# EAGLE design Display (EAGLE 9.6.2)
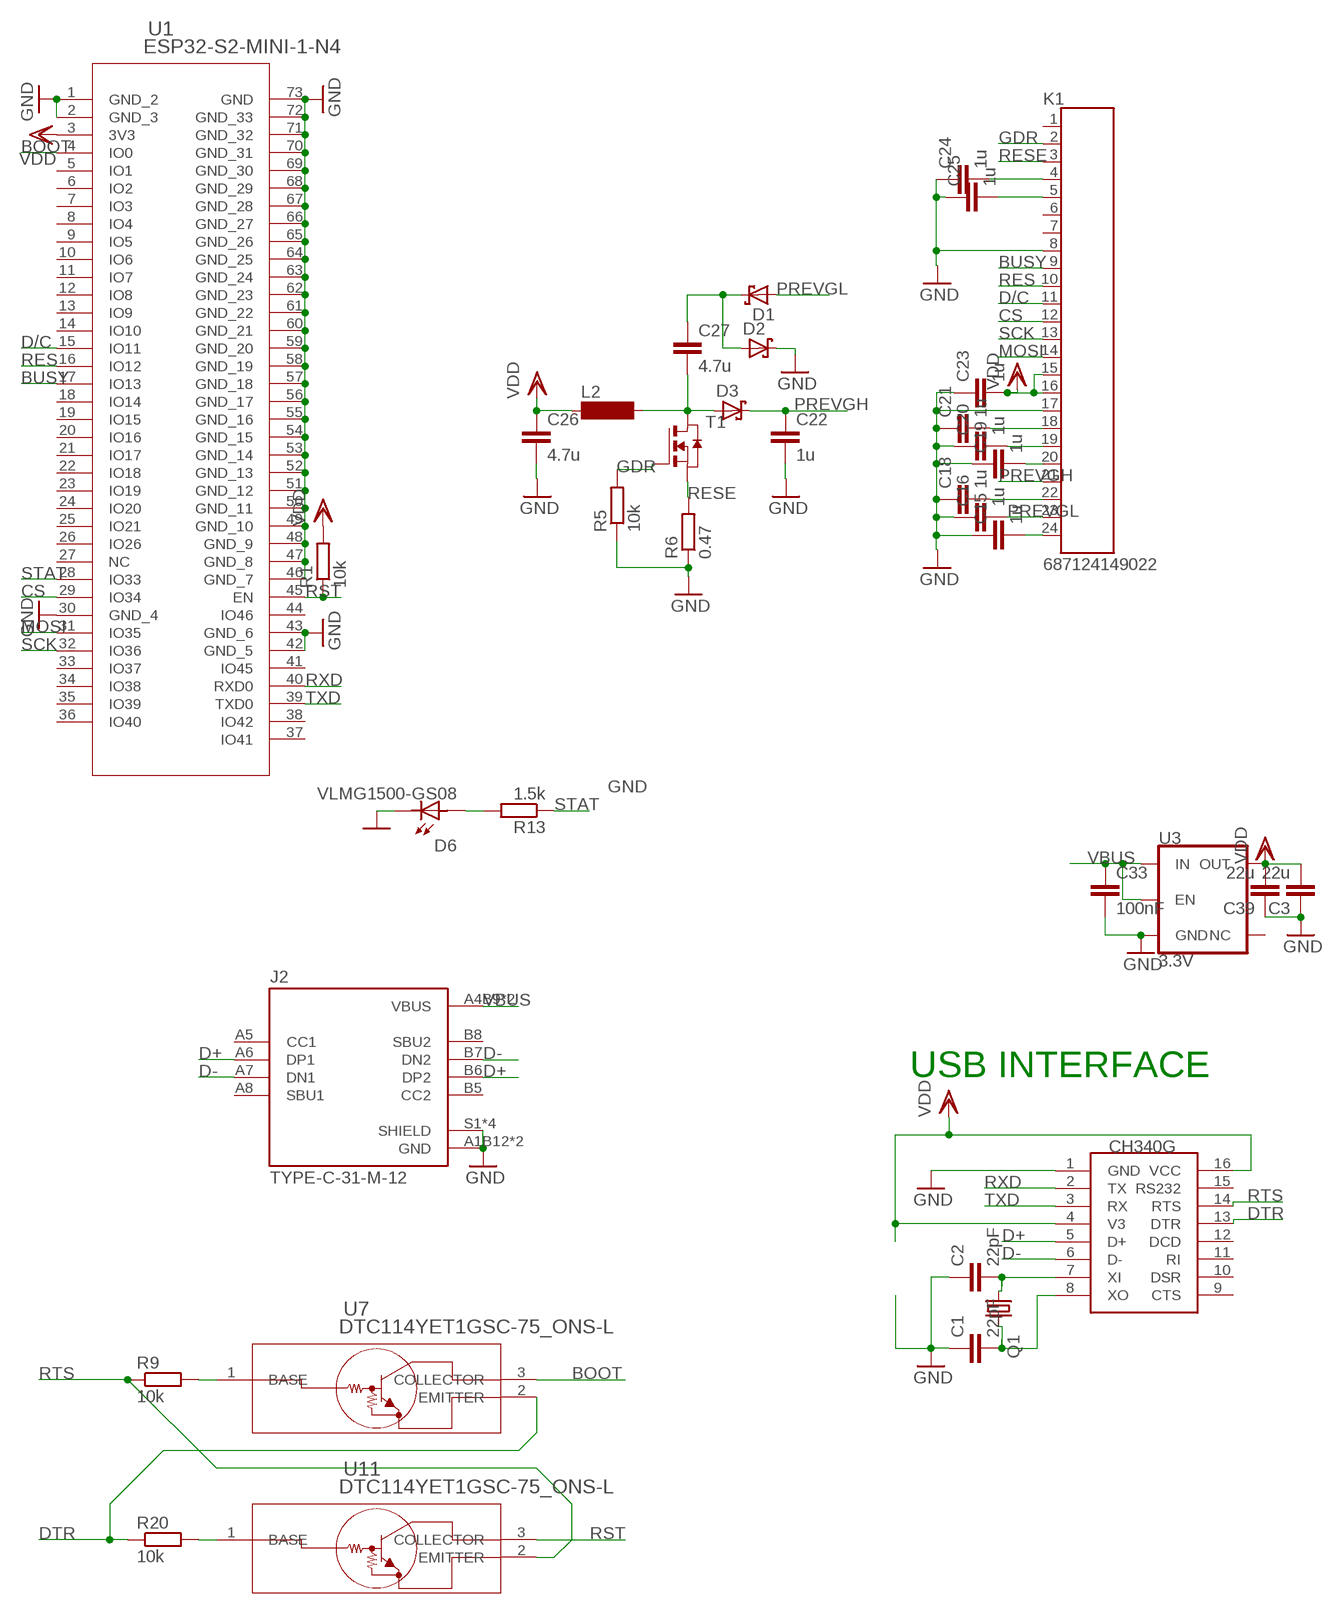
[diagram p0: schematic, sheet 1]

## Parts
C1  22pF  CC0402  [C0402]
C2  22pF  CC0402  [C0402]
C3  22u  CC0603R  [C0603R]
C15  1u  CC0402  [C0402]
C16  1u  CC0402  [C0402]
C18  1u  CC0402  [C0402]
C19  1u  CC0402  [C0402]
C20  1u  CC0402  [C0402]
C21  1u  CC0402  [C0402]
C22  1u  CC0402  [C0402]
C23  1u  CC0402  [C0402]
C24  1u  CC0402  [C0402]
C25  1u  CC0402  [C0402]
C26  4.7u  CC0402  [C0402]
C27  4.7u  CC0402  [C0402]
C33  100nF  CC0402  [C0402]
C39  22u  CC0603R  [C0603R]
D1  1PS79SB30,115  [SOD523]
D2  1PS79SB30,115  [SOD523]
D3  1PS79SB30,115  [SOD523]
D6  VLMG1500-GS08  [LEDC1005X35N]
J2  TYPE-C-31-M-12  [HRO_TYPE-C-31-M-12]
K1  687124149022  [687124149022]
L2  SM-NE29  [SM-NE29]
Q1  KX-7  [3.2X2.5_KX-7]
R1  10k  RR0402  [R0402]
R5  10k  RR0402  [R0402]
R6  0.47  RR0402  [R0402]
R9  10k  RR0402  [R0402]
R13  1.5k  RR0402  [R0402]
R20  10k  RR0402  [R0402]
T1  NMOSSOT23  [SOT-23]
U1  ESP32-S2-MINI-1-N4  [ESP32-S2-MINI-1-N4_EXP]
U3  3.3V  V_REG_AP2112K-3.3V  [SOT23-5]
U5  H  CH340G  [SOIC16]
U7  DTC114YET1GSC-75_ONS-L  [SC-75_ONS-L]
U11  DTC114YET1GSC-75_ONS-L  [SC-75_ONS-L]

## Nets
BOOT: U1.4(IO0) U7.3(COLLECTOR)
BUSY: K1.9 U1.17(IO13)
CS: K1.12 U1.29(IO34)
D+: J2.A6(DP1) J2.B6(DP2) U5.5(D+)
D-: J2.A7(DN1) J2.B7(DN2) U5.6(D-)
D/C: K1.11 U1.15(IO11)
DTR: R20.1 U5.13(DTR) U7.2(EMITTER)
GDR: K1.2 R5.2 T1.3(G)
GND: C1.1 C2.1 C3.1 C15.1 C16.1 C18.1 C19.1 C20.1 C21.1 C22.2 C23.1 C24.1 C25.1 C26.2 C33.2 C39.1 D2.1(K) D6.2 J2.A1B12(GND) J2.B1A12(GND) J2.S1(SHIELD) J2.S2(SHIELD) J2.S3(SHIELD) J2.S4(SHIELD) K1.8 K1.17 R5.1 R6.1 U1.1(GND_2) U1.2(GND_3) U1.30(GND_4) U1.42(GND_5) U1.43(GND_6) U1.46(GND_7) U1.47(GND_8) U1.48(GND_9) U1.49(GND_10) U1.50(GND_11) U1.51(GND_12) U1.52(GND_13) U1.53(GND_14) U1.54(GND_15) U1.55(GND_16) U1.56(GND_17) U1.57(GND_18) U1.58(GND_19) U1.59(GND_20) U1.60(GND_21) U1.61(GND_22) U1.62(GND_23) U1.63(GND_24) U1.64(GND_25) U1.65(GND_26) U1.66(GND_27) U1.67(GND_28) U1.68(GND_29) U1.69(GND_30) U1.70(GND_31) U1.71(GND_32) U1.72(GND_33) U1.73(GND) U3.2(GND) U5.1(GND)
MOSI: K1.14 U1.31(IO35)
N$5: C1.2 Q1.3 U5.8(XO)
N$7: C27.2 D3.2(A) L2.2 T1.1(D)
N$8: C21.2 K1.18
N$9: C2.2 Q1.1 U5.7(XI)
N$12: C18.2 K1.22
N$13: C20.2 K1.19
N$14: C19.2 K1.20
N$16: C15.2 K1.24
N$19: C24.2 K1.4
N$20: C25.2 K1.5
N$22: C27.1 D1.1(K) D2.2(A)
N$27: D6.1 R13.2
N$29: R20.2 U11.1(BASE)
N$30: R9.2 U7.1(BASE)
PREVGH: C22.1 D3.1(K) K1.21
PREVGL: C16.2 D1.2(A) K1.23
RES: K1.10 U1.16(IO12)
RESE: K1.3 R6.2 T1.2(S)
RST: R1.1 U1.45(EN) U11.3(COLLECTOR)
RTS: R9.1 U5.14(RTS) U11.2(EMITTER)
RXD: U1.40(RXD0) U5.2(TX)
SCK: K1.13 U1.32(IO36)
STAT: R13.1 U1.28(IO33)
TXD: U1.39(TXD0) U5.3(RX)
VBUS: C33.1 J2.A4B9(VBUS) J2.B4A9(VBUS) U3.1(IN) U3.3(EN)
VDD: C3.2 C23.2 C26.1 C39.2 K1.15 K1.16 L2.1 R1.2 U1.3(3V3) U3.5(OUT) U5.4(V3) U5.16(VCC)
Unconnected: J2.A5(CC1) J2.A8(SBU1) J2.B5(CC2) J2.B8(SBU2) K1.1 K1.6 K1.7 U1.5(IO1) U1.6(IO2) U1.7(IO3) U1.8(IO4) U1.9(IO5) U1.10(IO6) U1.11(IO7) U1.12(IO8) U1.13(IO9) U1.14(IO10) U1.18(IO14) U1.19(IO15) U1.20(IO16) U1.21(IO17) U1.22(IO18) U1.23(IO19) U1.24(IO20) U1.25(IO21) U1.26(IO26) U1.27(NC) U1.33(IO37) U1.34(IO38) U1.35(IO39) U1.36(IO40) U1.37(IO41) U1.38(IO42) U1.41(IO45) U1.44(IO46) U3.4(NC) U5.9(CTS) U5.10(DSR) U5.11(RI) U5.12(DCD) U5.15(RS232)

## Notes on the sheet
- USB INTERFACE

## Library data of the parts
C1 C2 C15 C16 C18-C27 C33 = eagle-ltspice:C: CAPACITOR, European symbol; SPICEMODEL: NONE; SPICEPREFIX: C
C3 C39 = eagle-ltspice:C: CAPACITOR, European symbol
D1-D3 = 1PS79SB30_115:1PS79SB30,115: 4 V, 30 mA low Cd Schottky barrier diode Planar low capacitance Schottky barrier diode encapsulated in a very small SMD plastic package. AAL Eindhoven MK; AVAILABILITY: Unavailable; DESCRIPTION: 1PS79SB30 Series 40 V 200 mA Surface Mount Schottky Barrier Diode - SOD-523; MF: Nexperia; MP: 1PS79SB30,115; PACKAGE: SOD-523 Nexperia; PRICE: None
D6 = VLMG1500-GS08:VLMG1500-GS08: 0402 GREEN 571nm 35MCD 65° Rectangle with Flat Top SMT LED; AVAILABILITY: Unavailable; DESCRIPTION: 0402 GREEN 571nm 35MCD 65° Rectangle with Flat Top SMT LED; MF: Vishay; MP: VLMG1500-GS08; PACKAGE: 0402 Vishay; PRICE: None
J2 = TYPE-C-31-M-12:TYPE-C-31-M-12: USB Connectors 24 Receptacle 1 8.94*7.3mm RoHS Check prices <https://pricing.snapeda.com/parts/TYPE-C-31-M-12/HRO%20Electronics%20Co.%2C%20Ltd./view-part?ref=eda>; AVAILABILITY: Not in stock; DESCRIPTION: USB Connectors 24 Receptacle 1 8.94*7.3mm RoHS; MF: HRO Electronics Co., Ltd.; MP: TYPE-C-31-M-12; PACKAGE: Package; PRICE: None
K1 = 687124149022:687124149022: WR-FPC 0.50mm SMT Horiz. Bot. Contact Hinge type WR-FPC 0.50mm 24 pins Hinge type SMT Horizontal Bottom Contact ;=>Code : Con_FPC_ZIF_0.50_6871xx149022_687124149022 <http://katalog.we-online.de/media/images/eican/Con_FPC_ZIF_0.50_687115149022_pf2.jpg> Details see: http://katalog.we-online.de/em/datasheet/6871xx149022.pdf Created 2014-10-08, Karrer Zheng 2014 (C) Wurth Elektronik; AVAILABILITY: Unavailable; DESCRIPTION: FFC / FPC Board Connector, WR-FPC Series, Surface Mount, Receptacle, 24, Bottom, 0.5 mm; MF: Wurth Electronics; MP: 687124149022; PACKAGE: None; PRICE: None
L2 = inductor-neosid:SM-NE29: INDUCTOR SMD chip inductor; OC_FARNELL: unknown; OC_NEWARK: unknown
Q1 = crystal-geyer_V1_0:KX: Quartz Crystals (MHz) SMD: KX - Serie Model Size l/w/h [mm] Frequency Range Frequency Stability Temp. Range [°C] Load Capacitance AECQ 200 availabel Datasheet KX-4 KX-5 KX-6 KX-7 KX-9A KX-9B KX-12A KX-12B KX-13 KX-20 KX-K KX-KS 1.6/1.2/0.3 2.0/1.6/0.45 2.5/2.0/0.55 3.2/2.5/0.8 5.0/3.2/1.0 5.0/3.2/1.1 6.0/3.5/1.1 6.0/3.5/1.0 7.0/5.0 /1.3 11.6/5.5/1.6 12.3/4.5/4.2 12.3/4.5/3.2 24.0 ~ 80.0 MHz 16.0 ~ 80.0 MHz 12.0 ~ 80.0 MHz 8.0 ~ 60.0 MHz 7,68 ~ 300,0 MHz 8,0 ~ 50,0 MHz 8,0 ~ 150,0 MHz 8,0 ~ 50,0 MHz 6,0 ~ 160,0 MHz 3,579 ~ 25,0 MHz 3,579 ~ 70,0 MHz 3,579 ~ 70,0 MHz ±10 … ±50ppm ±10 … ±50ppm ±10 … ±50ppm ±10 … ±50ppm ±10 … ±50ppm ±10 … ±50ppm ±10 … ±50ppm ±10 … ±50ppm ±10 … ±50ppm ±50ppm ±10 … ±50ppm ±10 … ±50ppm (*) -40°C …+85°C (*) -40°C …+125°C (*) -40°C …+125°C (*) -40°C …+125°C (*) -40°C …+105°C (*) -40°C …+105°C (*) -40°C …+125°C (*) -40°C …+105°C (*) -40°C …+105°C (*) -40°C …+105°C (*) -40°C …+85°C (*) -40°C …+85°C 8, 8…16 8, 8…16 10, 8…16 12, 7…20 16, 10…20 16, 10…20 16, 10…20 16, 12…20 16, 12…20 16, 12…20 16, 12…30 16, 12…30 - yes yes yes - - - - - - - - KX-4.pdf <http://www.geyer-electronic.de/uploads/tx_userartikelfrequenz/GEYER-KX-4.pdf> KX-5.pdf <http://www.geyer-electronic.de/uploads/tx_userartikelfrequenz/GEYER-KX-5.pdf> KX-6.pdf <http://www.geyer-electronic.de/uploads/tx_userartikelfrequenz/GEYER-KX-6.pdf> KX-7.pdf <http://www.geyer-electronic.de/uploads/tx_userartikelfrequenz/GEYER-KX-7.pdf> KX-9A.pdf <http://www.geyer-electronic.de/uploads/tx_userartikelfrequenz/GEYER-KX-9A.pdf> KX-9B.pdf <http://www.geyer-electronic.de/uploads/tx_userartikelfrequenz/GEYER-KX-9B.pdf> KX-12A.pdf <http://www.geyer-electronic.de/uploads/tx_userartikelfrequenz/GEYER-KX-12A.pdf> KX-12B.pdf <http://www.geyer-electronic.de/uploads/tx_userartikelfrequenz/GEYER-KX-12B.pdf> KX-13.pdf <http://www.geyer-electronic.de/uploads/tx_userartikelfrequenz/GEYER-KX-13.pdf> KX-20.pdf <http://www.geyer-electronic.de/uploads/tx_userartikelfrequenz/GEYER-KX-20.pdf> KX-K.pdf <http://www.geyer-electronic.de/uploads/tx_userartikelfrequenz/GEYER-KX-K.pdf> KX-KS.pdf <http://www.geyer-electronic.de/uploads/tx_userartikelfrequenz/GEYER-KX-KS.pdf> <http://www.geyer-electronic.de/fileadmin/template/img/logo-geyer-electronic.png> Details see: http://www.geyer-electronic.de/Frequenz-Produkte.9.0.html Created 2016-06-07, Hans Locher 2016 (C) Geyer Quartz Technology KX4,KX5,KX6,KX7,KX9A,KX9B,KX12A,KX12B,KX13,KX20,KXK,KXKS;1612;2016;2520;3225;5032;6035;7050;11655;12345;1,6x1,2;2,0x1,6;2,5x2,0;3,2x2,5;5,0x3,2;6,0x3,5;7,0x5,0;11,6x5,5;12,3x4,5;12,3x4,5;1.6x1.2;2.0x1.6;2.5x2.0;3.2x2.5;5.0x3.2;6.0x3.5;7.0x5.0;11.6x5.5;12.3x4.5;12.3x4.5;
R1 R5 R6 R9 R13 R20 = eagle-ltspice:R: RESISTOR, European symbol; SPICEMODEL: NONE; SPICEPREFIX: R
T1 = zetex:NMOSSOT23: MOS FET; OC_FARNELL: unknown; OC_NEWARK: unknown
U1 = ESP32-S2-MINI-1-N4:ESP32-S2-MINI-1-N4; COPYRIGHT: Copyright (C) 2022 Ultra Librarian. All rights reserved.; MANUFACTURER_PART_NUMBER: ESP32-S2-MINI-1-N4; MFR_NAME: Espressif Systems
U3 = SparkFun-IC-Power:V_REG_AP2112: AP2112 - 600mA CMOS LDO Regulator w/ Enable The AP2112 is CMOS process low dropout linear regulator with enable function, the regulator delivers a guaranteed 600mA (min.) continuous load current. Features Output Voltage Accuracy: ±1.5% Output Current: 600mA (Min.) Foldback Short Current Protection: 50mA Enable Function to Turn ON/OFF VOUT Low Dropout Voltage (3.3V): 250mV (Typ.) @IOUT=600mA Excellent Load Regulation: 0.2%/A (Typ.) Excellent Line Regulation: 0.02%/V (Typ.) Low Quiescent Current: 55μA (Typ.) Low Standby Current: 0.01μA (Typ.) Low Output Noise: 50μVRMS PSRR: 100Hz -65dB, 1kHz -65dB OTSD Protection Stable with 1.0μF Flexible Cap: Ceramic, Tantalum and Aluminum Electrolytic Operation Temperature Range: -40°C to 85°C ESD: MM 400V, HBM 4000V; PROD_ID: VREG-12457
U5 = ch340g:CH340G
U7 U11 = DTC114YET1G:DTC114YET1G; BUILT_BY: EMA_Justin; COPYRIGHT: Copyright (C) 2018 Accelerated Designs. All rights reserved; DATASHEET: https://www.onsemi.com/pub/Collateral/DTC114Y-D.PDF; MANUFACTURER_PART_NUMBER: DTC114YET1G; SOURCELIBRARY: ON_Semiconductor_2020-01-13; VENDOR: ON Semiconductor

## Board
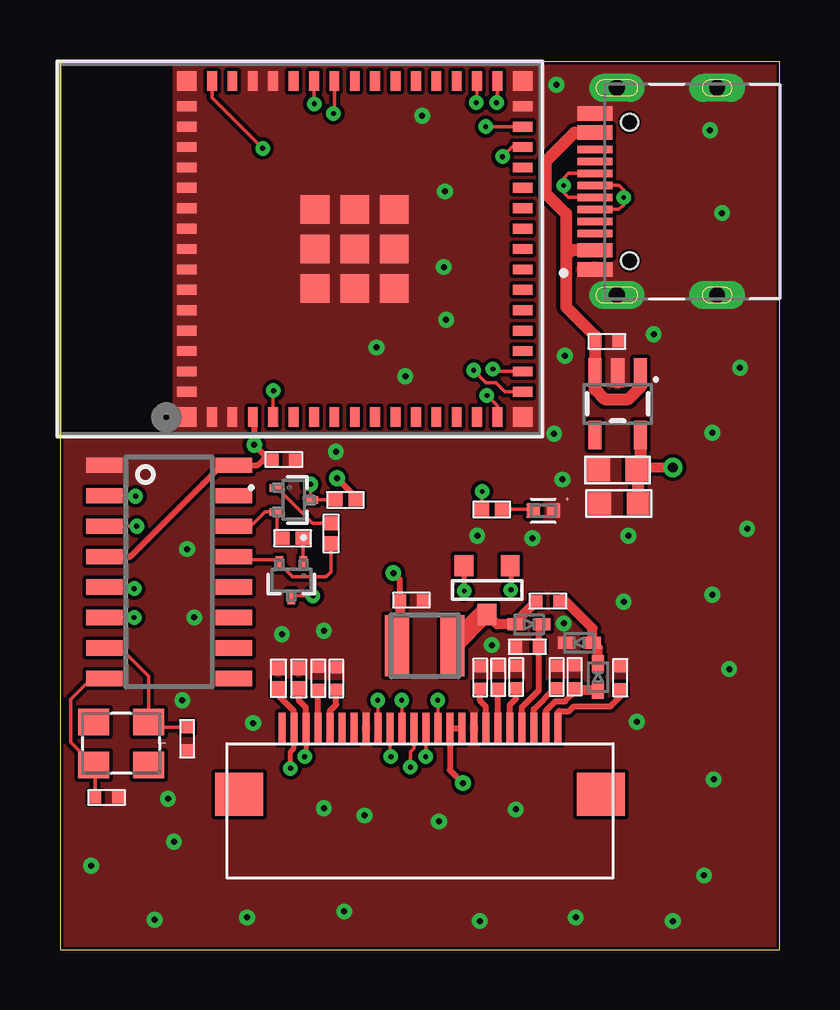
[diagram p1: board, top side]
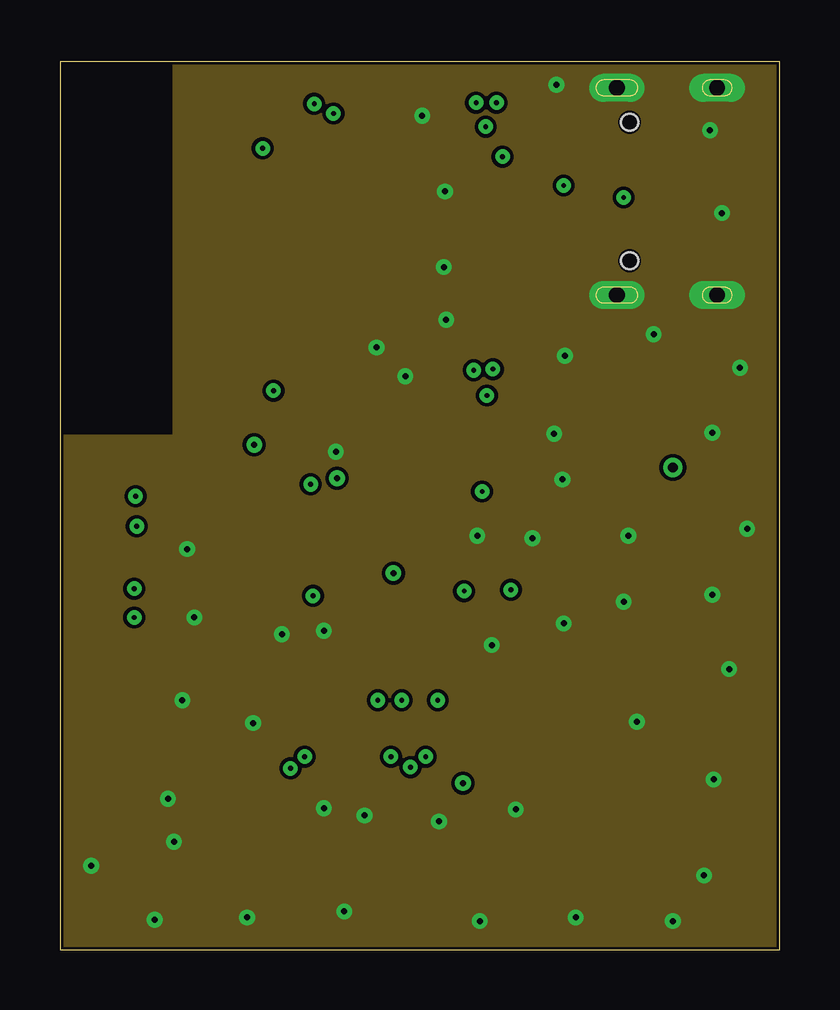
[diagram p2: board, inner layer Route2]
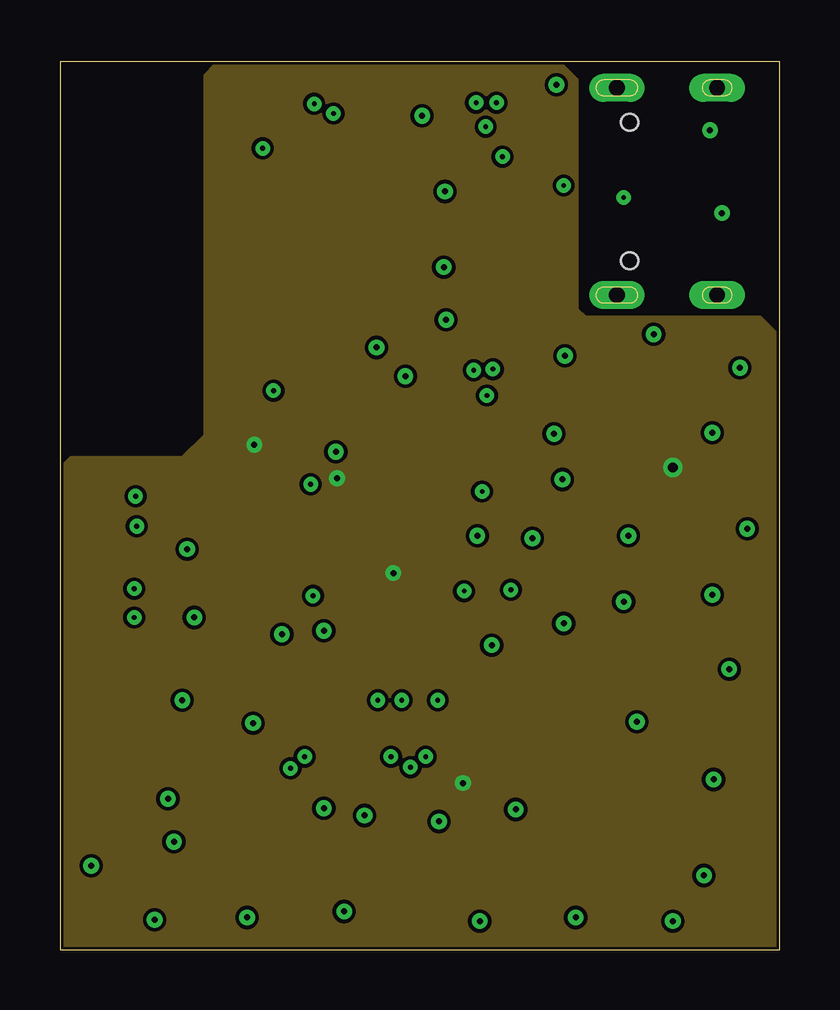
[diagram p3: board, inner layer Route15]
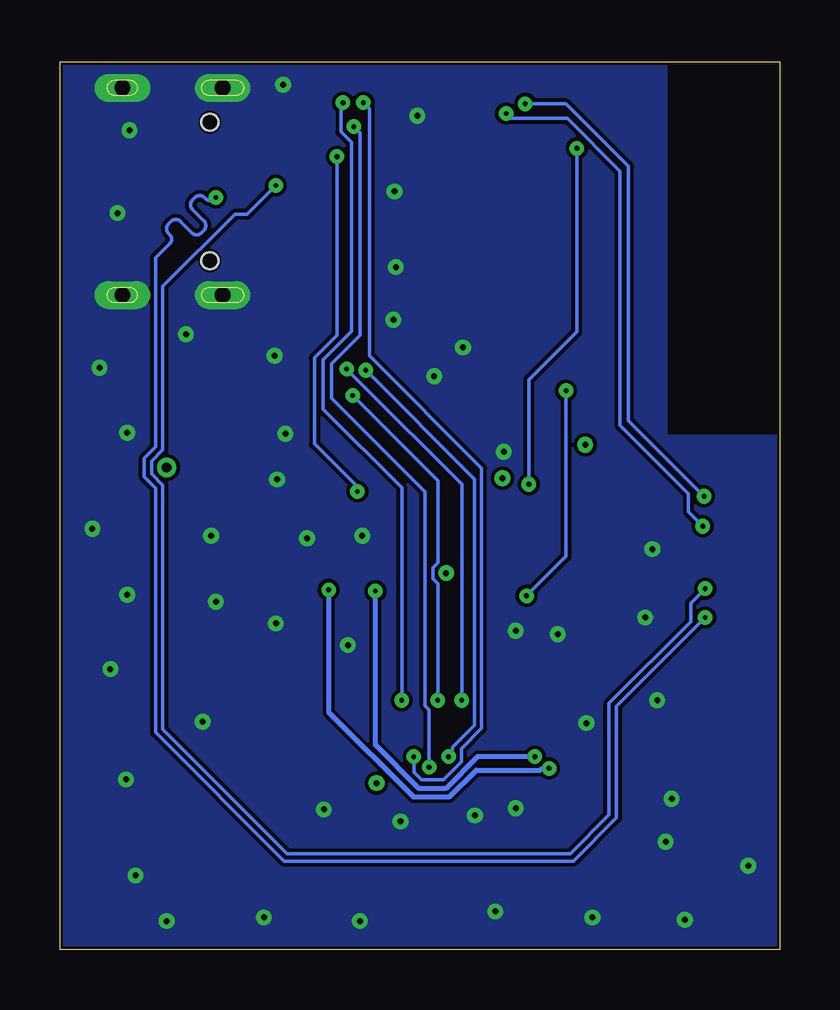
[diagram p4: board, bottom side, seen from below]

Size 30 x 37 mm. Coordinates in mm from the lower left corner, seen from the top.
Outline: 0,0 30,0 30,37 0,37 0,0
Copper layers (1+2*15+16): Top 0.035mm / dielectric 1.5mm / Route2 0.035mm / dielectric 0.15mm / Route15 0.035mm / dielectric 0.2mm / Bottom 0.035mm
Design rules "default *": minimum track width 5mil, minimum drill 0.2mm, track to track 6mil, track to pad 6mil, pad to pad 6mil, via to via 6mil, smd to smd 6mil, copper to edge 5mil, drill to drill 6mil, minimum pad ring 10mil, minimum via ring 8mil, stop-mask expansion 0mil, vias tented up to drill 40mil, thermal gap 0mil

### Footprints (pad centres in the part's own frame; a part is rotated, then mirrored left to right if it is on the bottom)
C0402 = smd 0.5 x 0.5: 1 -0.475,0; 2 0.475,0
C0603R = smd 0.95 x 0.95: 1 -0.85,0; 2 0.75,0
SOD523 = smd 0.7 x 0.5: 1 0.55,0; 2 -0.55,0
LEDC1005X35N = smd 0.59 x 0.61: 1 -0.415,0; 2 0.415,0
HRO_TYPE-C-31-M-12 = smd 0.6 x 1.45: A1B12 -3.25,5.095; A4B9 -2.45,5.095; B1A12 3.25,5.095; B4A9 2.45,5.095 | smd 0.3 x 1.45: A5 -1.25,5.095; A6 -0.25,5.095; A7 0.25,5.095; A8 1.25,5.095; B5 1.75,5.095; B6 0.75,5.095; B7 -0.75,5.095; B8 -1.75,5.095 | drill 0.65 pad 1.05 long: S1 -4.32,4.18; S2 4.32,4.18; S3 -4.32,0; S4 4.32,0 | hole 0.7: -2.89,3.65; 2.89,3.65
687124149022 = smd 0.3 x 1.3: 1 -5.75,0; 2 -5.25,0; 3 -4.75,0; 4 -4.25,0; 5 -3.75,0; 6 -3.25,0; 7 -2.75,0; 8 -2.25,0; 9 -1.75,0; 10 -1.25,0; 11 -0.75,0; 12 -0.25,0; 13 0.25,0; 14 0.75,0; 15 1.25,0; 16 1.75,0; 17 2.25,0; 18 2.75,0; 19 3.25,0; 20 3.75,0; 21 4.25,0; 22 4.75,0; 23 5.25,0; 24 5.75,0 | smd 2 x 1.8: Z1 -7.55,-2.75; Z2 7.55,-2.75
SM-NE29 = smd 1 x 2.54: 1 -1.15,0; 2 1.15,0
3.2X2.5_KX-7 = smd 1.3 x 1.1: 1 -1.15,-0.9; 2 1.15,-0.9; 3 1.15,0.9; 4 -1.15,0.9
R0402 = smd 0.6 x 0.55: 1 -0.425,0; 2 0.425,0
SOT-23 = smd 0.787 x 0.889: 1 0.025,-1.016; 2 -0.94,1.016; 3 0.991,1.016
ESP32-S2-MINI-1-N4_EXP = smd 0.813 x 0.406: 1 -7,3.661; 2 -7,2.811; 3 -7,1.961; 4 -7,1.111; 5 -7,0.261; 6 -7,-0.589; 7 -7,-1.439; 8 -7,-2.289; 9 -7,-3.139; 10 -7,-3.989; 11 -7,-4.839; 12 -7,-5.689; 13 -7,-6.539; 14 -7,-7.389; 15 -7,-8.239; 31 7,-8.239; 32 7,-7.389; 33 7,-6.539; 34 7,-5.689; 35 7,-4.839; 36 7,-3.989; 37 7,-3.139; 38 7,-2.289; 39 7,-1.439; 40 7,-0.589; 41 7,0.261; 42 7,1.111; 43 7,1.961; 44 7,2.811; 45 7,3.661 | smd 0.406 x 0.813: 16 -5.95,-9.289; 17 -5.1,-9.289; 18 -4.25,-9.289; 19 -3.4,-9.289; 20 -2.55,-9.289; 21 -1.7,-9.289; 22 -0.85,-9.289; 23 0,-9.289; 24 0.85,-9.289; 25 1.7,-9.289; 26 2.55,-9.289; 27 3.4,-9.289; 28 4.25,-9.289; 29 5.1,-9.289; 30 5.95,-9.289; 46 5.95,4.711; 47 5.1,4.711; 48 4.25,4.711; 49 3.4,4.711; 50 2.55,4.711; 51 1.7,4.711; 52 0.85,4.711; 53 0,4.711; 54 -0.85,4.711; 55 -1.7,4.711; 56 -2.55,4.711; 57 -3.4,4.711; 58 -4.25,4.711; 59 -5.1,4.711; 60 -5.95,4.711 | smd 1.194 x 1.194: 61 0,-2.289; 66 -1.65,-0.639; 67 0,-0.639; 68 1.65,-0.639; 69 -1.65,-2.289; 70 1.65,-2.289; 71 -1.65,-3.939; 72 0,-3.939; 73 1.65,-3.939 | smd 0.813 x 0.813: 62 -7,4.711; 63 -7,-9.289; 64 7,-9.289; 65 7,4.711
SOT23-5 = smd 0.55 x 1.2: 1 -0.95,-1.3; 2 0,-1.3; 3 0.95,-1.3; 4 0.95,1.3; 5 -0.95,1.3
SOIC16 = smd 0.635 x 1.524: 1 -4.445,-2.695; 2 -3.175,-2.695; 3 -1.905,-2.695; 4 -0.635,-2.695; 5 0.635,-2.695; 6 1.905,-2.695; 7 3.175,-2.695; 8 4.445,-2.695; 9 4.445,2.695; 10 3.175,2.695; 11 1.905,2.695; 12 0.635,2.695; 13 -0.635,2.695; 14 -1.905,2.695; 15 -3.175,2.695; 16 -4.445,2.695
SC-75_ONS-L = smd 0.305 x 0.61: 1 -0.5,-0.699; 2 0.5,-0.699; 3 0,0.699

### Placement (x,y rotation side)
C1  1.95,6.35 180 top
C2  5.3,8.8 90 top
C3  23.35,18.6 0 top
C15  23.36,11.34 270 top
C16  21.46,11.38 270 top
C18  20.71,11.37 270 top
C19  19.02,11.37 270 top
C20  18.27,11.36 270 top
C21  17.52,11.35 270 top
C22  19.49,12.63 180 top
C23  9.33,20.43 180 top
C24  10.77,11.32 270 top
C25  11.52,11.31 270 top
C26  14.65,14.57 0 top
C27  20.34,14.53 180 top
C33  22.8,25.35 0 top
C39  23.3,20 0 top
D1  22.43,11.37 90 top
D2  21.65,12.8 180 top
D3  19.55,13.56 0 top
D6  20.15,18.3 0 top
J2  27.4,31.6 90 top
K1  15.01,9.24 0 top
L2  15.21,12.67 0 top
Q1  2.55,8.6 180 top
R1  11.9,18.75 0 top
R5  9.11,11.32 270 top
R6  9.96,11.31 270 top
R9  9.7,17.15 0 top
R13  18,18.35 0 top
R20  11.3,17.35 90 top
T1  17.78,14.99 0 top
U1  10,29.2 90 top
U3  23.25,22.75 180 top
U5  4.55,15.75 270 top
U7  9.65,15.4 180 top
U11  9.75,18.75 270 top

### Tracks (layer width: path | path; a pad name or v marks a point on that pad's centre or on a via)
BOOT  (via drill 0.2)
  Top 0.15: U7.3 9.7,14.75 v10.55,14.75 | U1.4 8.89,23.29 v8.9,23.3
  Bottom 0.152: v8.9,23.3 8.9,16.4 v10.55,14.75
BUSY  (via drill 0.2)
  Top 0.15: K1.9 v13.26,10.39 v13.25,10.4 | U1.17 18.15,24.1 v18.05,24.2
  Bottom 0.15: v13.25,10.4 13.25,19.4 17.47,23.62 v18.05,24.2 | v18.05,24.2
CS  (via drill 0.2)
  Top 0.15: K1.12 14.76,8.41 14.61,8.26 v14.61,7.61 | U1.29 v17.75,34.3
  Bottom 0.15: v14.61,7.61 14.61,10.01 14.78,10.18 14.78,19.08 18.22,22.52 18.68,22.98 18.68,24.42
  Bottom 0.152: 18.68,24.42 17.5,25.6 17.5,34.05 v17.75,34.3
D+  (via drill 0.2)
  Top 0.15: J2.B6 21.2,32.35 21,32.15 v21,31.85 21,31.55 21.2,31.35 J2.A6 | U5.5 3.04,15.12 v3.1,15.05
  Bottom 0.152: v21,31.85 22.2,30.65 22.7,30.65 25.71,27.64 25.71,20.84 26.18,20.36 26.18,19.84 25.71,19.36 25.71,9.19 20.52,4 8.73,4 7.11,5.63 7.11,10.28 3.7,13.68 3.7,14.45 v3.1,15.05
D-  (via drill 0.2)
  Top 0.15: J2.A7 23.3,31.85 23.5,31.65 v23.5,31.35 23.5,31.05 23.3,30.85 J2.B7 | U5.6 v3.1,13.85
  Bottom 0.152: v3.1,13.85 6.8,10.15 6.8,5.5 8.6,3.7 20.65,3.7 26.01,9.06 26.01,19.24 26.49,19.71 26.49,20.49 26.01,20.96 26.01,28.84 25.43,29.43 arc-90 25.43,29.8 25.48,29.86 arc90 25.48,30.23 25.36,30.36 arc90 24.98,30.36 24.49,29.87 arc-90 24.12,29.87 23.99,29.99 arc-90 23.99,30.37 24.48,30.86 arc90 24.48,31.23 24.36,31.36 arc90 23.98,31.36 23.93,31.3 arc-90 23.55,31.3 v23.5,31.35
D/C  (via drill 0.2)
  Top 0.15: K1.11 v14.26,10.39 v14.25,10.4 | U1.15 18.24,22.66 v17.8,23.1
  Bottom 0.15: v17.8,23.1 14.25,19.55 14.25,16.14 14.46,15.93 14.46,15.47 14.25,15.26 v14.25,10.4
DTR
  Top 0.15: U5.13 7.38,16.25 9,16.25 U7.2 9.7,15.55 11.1,15.55 11.3,15.75 R20.1
GDR  (via drill 0.2)
  Top 0.2: T1.3 18.8,15.98 v18.8,15 | v9.61,7.56 9.61,8.25 9.76,8.4 K1.2
  Top 0.254: K1.2 9.76,9.94 9.11,10.59 R5.2
  Bottom 0.2: v18.8,15 18.8,9.9 15.27,6.37 13.77,6.37 12.64,7.49 9.97,7.49 9.9,7.56 v9.61,7.56
GND  (via drill 0.25)
  other vias: 25.55,1.2 26.85,3.1 21.5,1.35 12.7,5.6 27.25,7.1 19,5.85 24.05,9.5 15.8,5.35 20.7,36.05 27.1,34.15 27.6,30.7 15.1,34.75 16.05,31.6 16,28.45 16.1,26.25 14.4,23.9 13.2,25.1 5.6,13.85 5.1,10.4 5.3,16.7 11.5,20.75 18,12.7 8.05,9.45 4.5,6.3 1.3,3.5 3.95,1.25 21,13.6 23.5,14.5 19.7,17.15 17.4,17.25 20.6,21.5 21.05,24.75 28.35,24.25 24.75,25.65 11,5.9 17.5,1.2 11.85,1.6 7.8,1.35 4.75,4.5 27.9,11.7 20.95,19.6 11,13.3 9.25,13.15 23.7,17.25 28.65,17.55 27.2,14.8 27.2,21.55
  pour Top: 0.05,0 30,0 30,37 4.75,37 4.75,21.5 4.75,21.4 0,21.4 0,0
  pour Route2: 0,0 30,0 30,37 4.75,37 4.75,21.4 0,21.4
  pour Bottom: 0,0 30,0 30,37 4.75,37 4.75,21.4 0,21.4
MOSI  (via drill 0.2)
  Top 0.15: K1.14 v15.76,10.39 v15.75,10.4 | U1.31 18.24,35.34 v18.2,35.3
  Bottom 0.15: v15.75,10.4 15.75,19.25 19.03,22.53 19.03,24.59 17.85,25.78
  Bottom 0.152: v18.2,35.3 18.23,35.3 18.28,35.25 18.28,34.08 17.85,33.65 17.85,25.78
N$5
  Top 0.15: C1.2 1.48,7.62 Q1.3 0.45,8.65 0.45,10.45 1.3,11.3 U5.8
N$7
  Top 0.406: 17.66,13.97 T1.1 18.22,13.56 D3.2 19,13.66 C27.2
  Top 0.813: L2.2 17.66,13.97
N$8
  Top 0.254: K1.18 17.76,10.14 17.52,10.38 C21.2
N$9
  Top 0.15: C2.2 3.92,9.28 Q1.1 3.7,11.4 2.52,12.57 U5.7
N$12
  Top 0.254: K1.22 19.76,10.04 20.62,10.89 C18.2
N$13
  Top 0.254: K1.19 C20.2
N$14
  Top 0.254: K1.20 18.76,10.21 19.02,10.47 C19.2
N$16
  Top 0.254: K1.24 20.76,9.89 20.82,9.94 21.23,9.94 21.43,10.15 22.95,10.15 23.36,10.56 C15.2
N$19
  Top 0.254: K1.4 10.76,10.84 C24.2
N$20
  Top 0.254: K1.5 11.26,9.96 11.52,10.22 C25.2
N$22
  Top 0.406: C27.1 20.86,14.58 21.02,14.58 22.2,13.39 D2.2 22.43,12.57 D1.1
N$27
  Top 0.152: R13.2 19.68,18.35 D6.1
N$29
  Top 0.15: U11.1 10.53,17.77 R20.2
N$30
  Top 0.15: U7.1 10.12,16.12 R9.2
PREVGH
  Top 0.254: K1.21 19.26,10.11 19.96,10.81 C22.1 19.96,13.43 D3.1
PREVGL
  Top 0.254: K1.23 20.26,9.96 20.65,10.35 21.06,10.35 21.46,10.75 C16.2
  Top 0.406: D1.2 21.55,10.82 C16.2
RES  (via drill 0.2)
  Top 0.15: K1.10 13.76,8.09 v13.8,8.05 | v17.25,24.15 17.77,23.63 18.17,23.63 18.55,23.25 U1.16
  Bottom 0.15: v13.8,8.05 13.63,8.22 13.63,8.45 12.72,9.36 12.72,19.62 v17.25,24.15
RESE  (via drill 0.2)
  Top 0.2: K1.3 10.26,8.11 v10.2,8.05 | T1.2 16.85,16 v16.85,14.95
  Top 0.254: K1.3 10.26,10.09 9.96,10.39 R6.2
  Bottom 0.2: v10.2,8.05 12.59,8.05 13.91,6.72 15.04,6.72 16.85,8.54 v16.85,14.95
RST  (via drill 0.2)
  Top 0.15: R1.1 U11.3 v10.45,19.4
  Top 0.152: v8.45,33.4 6.34,35.51 U1.45
  Bottom 0.152: v10.45,19.4 10.45,23.75 8.45,25.75 v8.45,33.4
RTS
  Top 0.15: U5.14 7.96,17.66 8.55,18.25 U11.2 9.05,17.37 R9.1
RXD  (via drill 0.2)
  Top 0.15: U5.2 3.12,18.93 v3.15,18.9 | U1.40 v10.6,35.25
  Bottom 0.15: v3.15,18.9 6.3,22.05 6.3,32.65 8.9,35.25 v10.6,35.25
SCK  (via drill 0.2)
  Top 0.15: K1.13 v15.26,8.06 v15.25,8.05 | U1.32 17.39,35.34 v17.35,35.3
  Bottom 0.15: v15.25,8.05 15.25,7.4 14.93,7.08 14.02,7.08 13.27,7.83 13.27,8.38 12.42,9.23 12.42,20.07 17.1,24.75 17.1,35.05 v17.35,35.3
STAT  (via drill 0.2)
  Top 0.15: U1.28 19.19,33.55 18.94,33.55 v18.45,33.06 v18.45,33.05
  Top 0.152: v17.6,19.1 17.6,18.38 R13.1
  Bottom 0.152: v18.45,33.05 18.45,25.61 19.39,24.67 19.39,21.09 17.6,19.3 v17.6,19.1
TXD  (via drill 0.2)
  Top 0.15: U5.3 v3.19,17.66 v3.2,17.65 | U1.39 11.44,34.89 v11.4,34.85
  Bottom 0.15: v11.4,34.85 11.2,34.65 8.85,34.65 6.65,32.45 6.65,21.85 3.8,19 3.8,18.25 v3.2,17.65
VBUS
  Top 0.508: J2.A4B9 21.35,29.15 21.1,28.9 | 21.1,28.9 21.1,26.8 22.32,25.57 C33.1 22.3,25.32 U3.3 22.3,23.35 22.7,22.95 23.7,22.95 24.2,23.45 U3.1 | 21.1,28.9 21.1,30.68 20.26,31.51 20.26,32.86 21.45,34.05 J2.B4A9
VDD  (via drill 0.25, 0.4)
  Top 0.254: K1.16 K1.15 16.26,7.49 v16.8,6.95 | C26.1 14.18,15.43 v13.9,15.7 | U1.3 8.1,22.14 v8.1,21.05 8.72,20.43 C23.2 8.48,20.43 8.24,20.2 U5.16 6.75,20.2 2.94,16.39 U5.4 | R1.2 12.32,18.88 v11.55,19.65 | L2.1 14.06,13.38 14.18,13.5
  Top 0.406: C26.1 14.18,13.5 14.18,13.47 14.1,13.4 | C39.2 24.15,20.1 v25.55,20.1
  Top 0.508: U3.5 24.2,20.15 C39.2 24.1,19.95 C3.2
  pour Route15: -0.05,-0.05 30,-0.05 30,25.55 29.2,26.35 21.9,26.35 21.55,26.7 21.55,36.25 20.95,36.85 6.45,36.85 6.05,36.45 6.05,21.45 5.1,20.5 0.45,20.5 0.05,20.1 0.05,0.05